# Altium schematic sheet ID_logic.SchDoc: DIO MCX 16 Isolated
size A4; DocumentNumber: 4; SheetNumber: 4; SheetTotal: 7; ModifiedBy: -; CreateDate: XX/XX/XXXX; CheckedDate: -; Title2: Title2; DivGrp: CTI
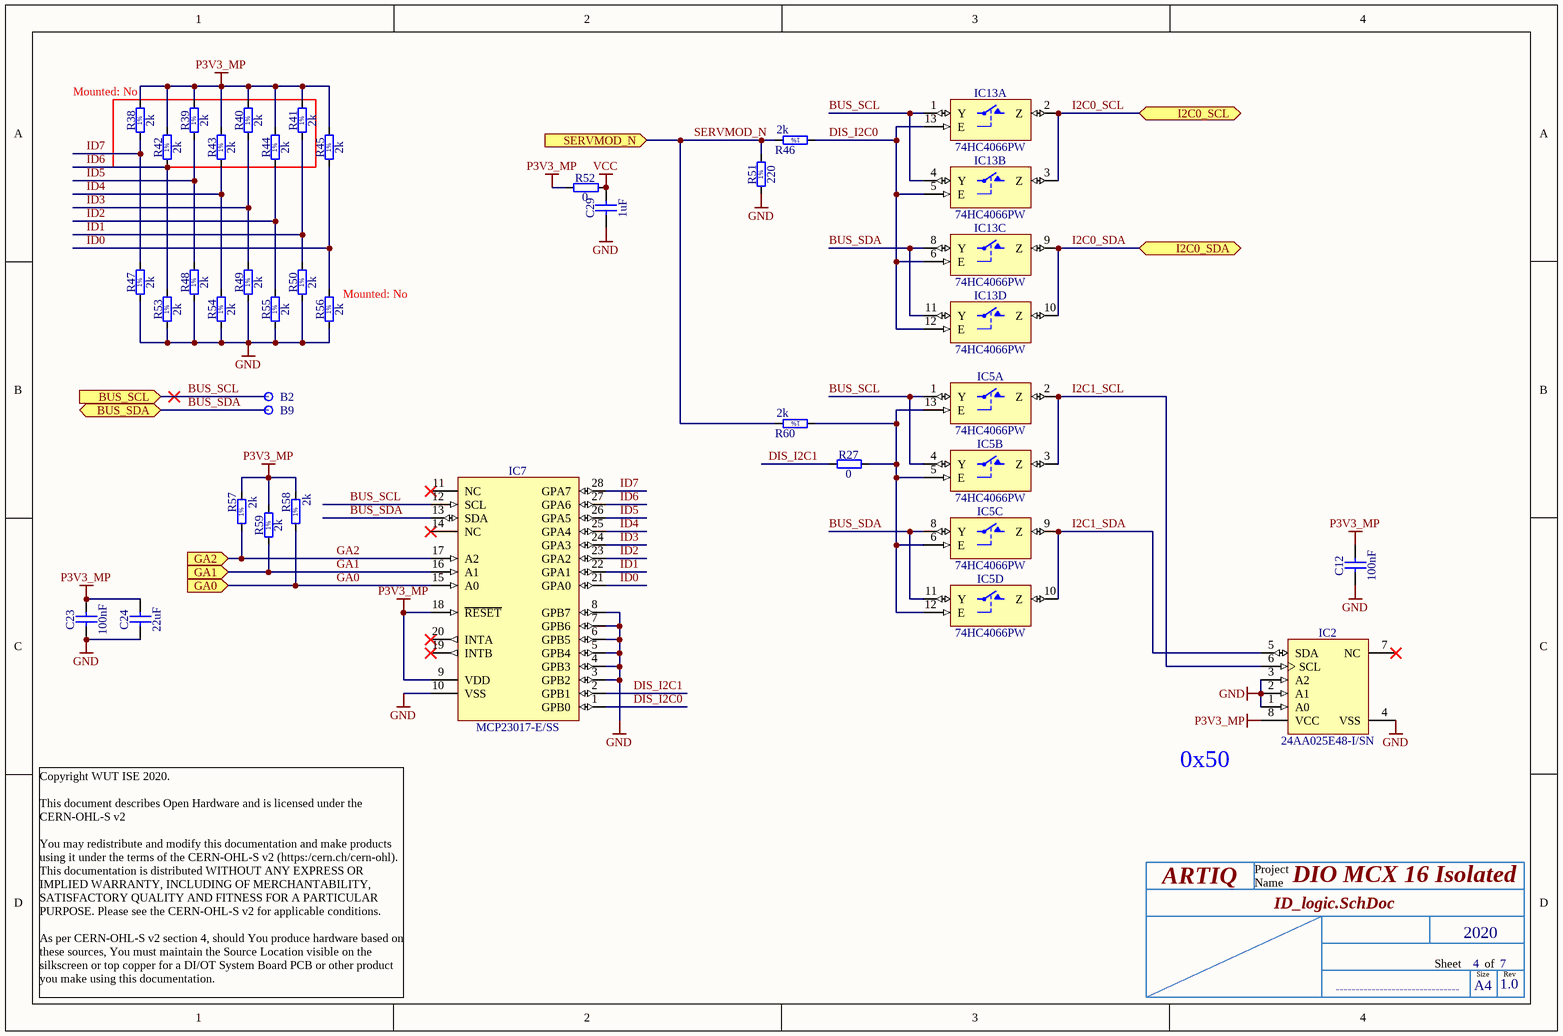
[diagram p0: ID_logic.SchDoc]

## Parts
B2  Plated Hole  [c130h60]  (value not drawn)
B9  Plated Hole  [c130h60]  (value not drawn)
C12  100nF  [CAPC1005X55N]
C23  100nF  [CAPC1005X55N]
C24  22uF  [CAPC1709X100N]
C29  1uF  [CAPC2012X140N]
IC2  24AA025E48-I/SN  [SOIC127P600X175-8N]
IC5  74HC4066PW  [SOP65P640X110-14N]  (parts A,B,C,D of 4)
IC7  MCP23017-E/SS  [SOP65P780X200-28N]
IC13  74HC4066PW  [SOP65P640X110-14N]  (parts A,B,C,D of 4)
R27  0  [RESC1005X40N]
R38  2k  Mounted: No  [RESC1608X55N]
R39  2k  [RESC1608X55N]
R40  2k  [RESC1608X55N]
R41  2k  [RESC1608X55N]
R42  2k  [RESC1608X55N]
R43  2k  [RESC1608X55N]
R44  2k  [RESC1608X55N]
R45  2k  [RESC1608X55N]
R46  2k  [RESC1608X55N]
R47  2k  [RESC1608X55N]
R48  2k  [RESC1608X55N]
R49  2k  [RESC1608X55N]
R50  2k  [RESC1608X55N]
R51  220  [RESC1608X55N]
R52  0  [RESC1005X40N]
R53  2k  [RESC1608X55N]
R54  2k  [RESC1608X55N]
R55  2k  [RESC1608X55N]
R56  2k  Mounted: No  [RESC1608X55N]
R57  2k  [RESC1608X55N]
R58  2k  [RESC1608X55N]
R59  2k  [RESC1608X55N]
R60  2k  [RESC1608X55N]

## Ports
BUS_SCL (in), BUS_SDA (bidir), GA0 (in), GA1 (in), GA2 (in), I2C0_SCL (bidir), I2C0_SDA (bidir), SERVMOD_N (in)

## Nets
GND: C12.1 C23.1 C24.1 C29.1 IC2.1(A0) IC2.2(A1) IC2.3(A2) IC2.4(VSS) IC5.7(GND) IC7.3(GPB2) IC7.4(GPB3) IC7.5(GPB4) IC7.6(GPB5) IC7.7(GPB6) IC7.8(GPB7) IC7.10(VSS) IC13.7(GND) R47.1 R48.1 R49.1 R50.1 R51.1 R53.1 R54.1 R55.1 R56.1
P3V3_MP: C12.2 C23.2 C24.2 IC2.8(VCC) IC7.9(VDD) IC7.18(~{RESET}) R38.2 R39.2 R40.2 R41.2 R42.2 R43.2 R44.2 R45.2 R52.1 R57.2 R58.2 R59.2
VCC: C29.2 IC5.14(VCC) IC13.14(VCC) R52.2
BUS_SCL: B2.1 IC5.1(Y) IC5.4(Y) IC7.12(SCL) IC13.1(Y) IC13.4(Y) ; port BUS_SCL
BUS_SDA: B9.1 IC5.8(Y) IC5.11(Y) IC7.13(SDA) IC13.8(Y) IC13.11(Y) ; port BUS_SDA
DIS_I2C0: IC7.1(GPB0) IC13.5(E) IC13.6(E) IC13.12(E) IC13.13(E) R46.1
DIS_I2C1: IC7.2(GPB1) R27.1
GA0: IC7.15(A0) R58.1 ; port GA0
GA1: IC7.16(A1) R59.1 ; port GA1
GA2: IC7.17(A2) R57.1 ; port GA2
I2C0_SCL: IC13.2(Z) IC13.3(Z) ; port I2C0_SCL
I2C0_SDA: IC13.9(Z) IC13.10(Z) ; port I2C0_SDA
I2C1_SCL: IC2.6(SCL) IC5.2(Z) IC5.3(Z)
I2C1_SDA: IC2.5(SDA) IC5.9(Z) IC5.10(Z)
ID0: IC7.21(GPA0) R45.1 R56.2
ID1: IC7.22(GPA1) R41.1 R50.2
ID2: IC7.23(GPA2) R44.1 R55.2
ID3: IC7.24(GPA3) R40.1 R49.2
ID4: IC7.25(GPA4) R43.1 R54.2
ID5: IC7.26(GPA5) R39.1 R48.2
ID6: IC7.27(GPA6) R42.1 R53.2
ID7: IC7.28(GPA7) R38.1 R47.2
SERVMOD_N: R46.2 R51.2 R60.2 ; port SERVMOD_N
NetIC5_5: IC5.5(E) IC5.6(E) IC5.12(E) IC5.13(E) R27.2 R60.1

Not connected (* = marked no-connect by the designer): IC2 7(NC)*; IC7 11(NC)* 14(NC)* 19(INTB)* 20(INTA)*

## Notes on the sheet
- 0x50
- ARTIQ
- Project
- Name
- Sheet
- 2020
- Size
- A4
- of
- 1.0
- Rev
- Copyright WUT ISE 2020.
  This document describes Open Hardware and is licensed under the CERN-OHL-S v2
  You may redistribute and modify this documentation and make products using it under the terms of the CERN-OHL-S v2 (https:/cern.ch/cern-ohl). This documentation is distributed WITHOUT ANY EXPRESS OR IMPLIED WARRANTY, INCLUDING OF MERCHANTABILITY, SATISFACTORY QUALITY AND FITNESS FOR A PARTICULAR PURPOSE. Please see the CERN-OHL-S v2 for applicable conditions.
  As per CERN-OHL-S v2 section 4, should You produce hardware based on these sources, You must maintain the Source Location visible on the silkscreen or top copper for a DI/OT System Board PCB or other product you make using this documentation.
- -------------------------------
- (in symbol R0603_2K_1%_0.1W_100PPM) 1%
- (in symbol R0603_220R_1%_0.1W_100PPM) 1%

## Library data of the parts
B2 B9 = PLATED_HOLE0.6_PAD1.3: Single Terminal Socket; Part Description: Plated Through Hole: Hole Dia.=0.6mm Pad Dia.=1.3mm; Mounted: No; Part Number: PLATED_HOLE0.6_PAD1.3; Component Kind: Standard (No BOM); Component Type: Standard (No BOM); Pin Count: 1; Family: Plated Hole; Socket: No; SMD: No; Sense: No; Status: None; ComponentHeight: 0mm; HelpURL: Undefined; Author: CERN DEM MR; CreateDate: 02.03.2016; LatestRevisionDate: 02.03.2016; PackageDescription: Plated Through Hole: Hole Dia.=0.6mm Pad Dia.=1.3mm
C12 C23 = CC0402_100NF_16V_10%_X5R: Non-polarised capacitor; Part Description: SMD Multilayer Chip Ceramic Capacitor; Manufacturer: GENERIC; Manufacturer1 Part Number: GRM155R61C104KA88D; Voltage: 16V; TC: X5R; Tolerance: ±10%; Part Number: CC0402_100NF_16V_10%_X5R; Component Kind: Standard; Component Type: Standard; Pin Count: 2; Value: 100nF; Status: None; Manufacturer Part Number: CC0402_100NF_16V_10%_X5R; Case: 0402; Mounted: Yes; Socket: No; SMD: Yes; Sense: No; Manufacturer1 Example: MURATA; Manufacturer1 ComponentHeight: 0.55mm; HelpURL: \\cern.ch\dfs\Applications\Altium\Datasheets\CC0402_X5R_MURATA_GRM.pdf; Author: CERN DEM JLC; CreateDate: 10.12.2013; LatestRevisionDate: 10.12.2013
C24 = CC0603_22UF_6.3V_20%_X5R: Non-polarised capacitor; Part Description: SMD Multilayer Chip Ceramic Capacitor; Manufacturer: GENERIC; Manufacturer1 Part Number: C1608X5R0J226M080; Voltage: 6.3V; TC: X5R; Tolerance: ±20%; Part Number: CC0603_22UF_6.3V_20%_X5R; Component Kind: Standard; Component Type: Standard; Pin Count: 2; Value: 22uF; Status: None; Manufacturer Part Number: CC0603_22UF_6.3V_20%_X5R; Case: 0603; Mounted: Yes; Socket: No; SMD: Yes; Sense: No; Manufacturer1 Example: TDK; Manufacturer1 ComponentHeight: 1mm; HelpURL: \\cern.ch\dfs\Applications\Altium\Datasheets\CC0603_X5R_TDK_C.pdf; Author: CERN DEM JLC; CreateDate: 16.12.2013; LatestRevisionDate: 13.09.2016
C29 = CC0805_1UF_35V_20%_X7R: Non-polarised capacitor; Part Description: SMD Multilayer Chip Ceramic Capacitor; Manufacturer: GENERIC; Manufacturer1 Part Number: GMK212B7105MG-T; Voltage: 35V; TC: X7R; Tolerance: ±20%; Part Number: CC0805_1UF_35V_20%_X7R; Component Kind: Standard; Component Type: Standard; Pin Count: 2; Value: 1uF; Status: Not Recommended; Manufacturer Part Number: CC0805_1UF_35V_20%_X7R; Case: 0805; Mounted: Yes; Socket: No; SMD: Yes; Sense: No; Manufacturer1 Example: TAIYO YUDEN; Manufacturer1 ComponentHeight: 1.35mm; HelpURL: \\cern.ch\dfs\Applications\Altium\Datasheets\CC0805_X7R_TAIYO-YUDEN_HIGH-VALUE.pdf; Author: CERN DEM JLC; CreateDate: 22.06.2011; LatestRevisionDate: 22.06.2011
IC2 = 24AA025E48-I/SN: 1.7V-5.5V, 2K I2C™ Serial EEPROMs with EUI-48™ Node Identity; Manufacturer: MICROCHIP TECHNOLOGY; PressFit: No; Bonding: No; Part Number: 24AA025E48-I/SN; Component Kind: Standard; Component Type: Standard; Device: 24AA025E48-I/SN; PackageDescription: SOIC 8, Pitch 1.27mm - Body 4x5mm, IPC Medium Density; Part Description: 1.7V-5.5V, 2K I2C™ Serial EEPROMs with EUI-48™ Node Identity; Manufacturer Part Number: 24AA025E48-I/SN; Pin Count: 8; Case: SOIC8; Mounted: Yes; Socket: No; SMD: Yes; Sense: No; ComponentHeight: 1.75mm; HelpURL: \\cern.ch\dfs\Applications\Altium\Datasheets\24AA025E48-I-SN.pdf; Author: CERN DEM MR; CreateDate: 19.07.2016; LatestRevisionDate: 19.07.2016
IC5 IC13 = 74HC4066PW: Part Description: Quad Single-Pole Single-Throw Analog Switch; Manufacturer: NXP SEMICONDUCTORS; PressFit: No; Bonding: No; Part Number: 74HC4066PW; Component Kind: Standard; Component Type: Standard; Device: 74HC4066PW; PackageDescription: SOP, 14-Leads, Body 4.4x5mm (max), Pitch 0.65mm, IPC Medium Density; Manufacturer Part Number: 74HC4066PW; Pin Count: 14; Case: TSSOP14; Mounted: Yes; Socket: No; SMD: Yes; Sense: No; ComponentHeight: 1.1mm; Author: CERN DEM JLC; HelpURL: \\cern.ch\dfs\Applications\Altium\Datasheets\74HC4066PW.pdf; CreateDate: 19.11.2014; LatestRevisionDate: 19.11.2014
IC7 = MCP23017-E/SS: 16-bit I/O Port Expander With Serial Interface; Manufacturer: MICROCHIP TECHNOLOGY; PressFit: No; Bonding: No; Part Number: MCP23017-E/SS; Component Kind: Standard; Component Type: Standard; Device: MCP23017-E/SS; PackageDescription: SOP, 0.65mm Pitch; 28 pin, 5.30mm W X 10.20mm L X 2.00mm H body, IPC Medium Density; Part Description: 16-bit I/O Port Expander With Serial Interface; Manufacturer Part Number: MCP23017-E/SS; Pin Count: 28; Case: SSOP28; Mounted: Yes; Socket: No; SMD: Yes; Sense: No; ComponentHeight: 2mm; Author: CERN DEM JLC; HelpURL: \\cern.ch\dfs\Applications\Altium\Datasheets\MCP23017-E-SS.pdf; CreateDate: 17/01/2011; LatestRevisionDate: 17/01/2011
R27 R52 = R0402_0R_JUMPER: Resistor; Part Description: 1A (0.05R Max DC Resistance) Zero Ohm Jumper; Manufacturer: GENERIC; Manufacturer1 Part Number: 232270591001L; PressFit: No; Part Number: R0402_0R_JUMPER; Component Kind: Standard; Component Type: Standard; Pin Count: 2; Value: 0; Status: Not Recommended; Manufacturer Part Number: R0402_0R_JUMPER; Case: 0402; Mounted: Yes; Sense: No; Socket: No; SMD: Yes; Manufacturer1 Example: YAGEO PHYCOMP; Manufacturer1 ComponentHeight: 0.4mm; HelpURL: \\cern.ch\dfs\Applications\Altium\Datasheets\R0402_Phycomp_RC0402.pdf; Author: CERN DEM JLC; CreateDate: 03.12.2007; LatestRevisionDate: 17.10.2012
R38 R45-R50 R53-R60 = R0603_2K_1%_0.1W_100PPM: Resistor - 1%; Part Description: General Purpose Thick Film Chip Resistor; Manufacturer: GENERIC; Manufacturer1 Part Number: NRC06F2001TRF; Power: 0.1W; TC: ±100ppm/°C; PressFit: No; Part Number: R0603_2K_1%_0.1W_100PPM; Component Kind: Standard; Component Type: Standard; Pin Count: 2; Value: 2k; Status: Preferred; Tolerance: ±1%; Manufacturer Part Number: R0603_2K_1%_0.1W_100PPM; Case: 0603; Sense: No; Socket: No; SMD: Yes; Manufacturer1 Example: NIC COMPONENT; Manufacturer1 ComponentHeight: 0.55mm; HelpURL: \\cern.ch\dfs\Applications\Altium\Datasheets\R0603_NIC_NRC.pdf; Author: CERN DEM JLC; CreateDate: 03/12/2007; LatestRevisionDate: 13/03/2008
  R38 R56: ClassName: NotMounted
  R45-R50 R53-R55 R57-R60: Mounted: Yes
R39-R44 = R0603_2K_1%_0.1W_100PPM: Resistor - 1%; Part Description: General Purpose Thick Film Chip Resistor; Manufacturer: GENERIC; Manufacturer1 Part Number: NRC06F2001TRF; Power: 0.1W; TC: ±100ppm/°C; PressFit: No; Mounted: No; Part Number: R0603_2K_1%_0.1W_100PPM; Component Kind: Standard; Component Type: Standard; Pin Count: 2; Value: 2k; Status: Preferred; Tolerance: ±1%; Manufacturer Part Number: R0603_2K_1%_0.1W_100PPM; Case: 0603; Sense: No; Socket: No; SMD: Yes; Manufacturer1 Example: NIC COMPONENT; Manufacturer1 ComponentHeight: 0.55mm; HelpURL: \\cern.ch\dfs\Applications\Altium\Datasheets\R0603_NIC_NRC.pdf; Author: CERN DEM JLC; CreateDate: 03/12/2007; LatestRevisionDate: 13/03/2008; ClassName: NotMounted
R51 = R0603_220R_1%_0.1W_100PPM: Resistor - 1%; Part Description: General Purpose Thick Film Chip Resistor; Manufacturer: GENERIC; Manufacturer1 Part Number: NRC06F2200TRF; Power: 0.1W; TC: ±100ppm/°C; PressFit: No; Part Number: R0603_220R_1%_0.1W_100PPM; Component Kind: Standard; Component Type: Standard; Pin Count: 2; Value: 220; Status: Preferred; Tolerance: ±1%; Manufacturer Part Number: R0603_220R_1%_0.1W_100PPM; Case: 0603; Mounted: Yes; Sense: No; Socket: No; SMD: Yes; Manufacturer1 Example: NIC COMPONENT; Manufacturer1 ComponentHeight: 0.55mm; HelpURL: \\cern.ch\dfs\Applications\Altium\Datasheets\R0603_NIC_NRC.pdf; Author: CERN DEM JLC; CreateDate: 03.12.2007; LatestRevisionDate: 13.03.2008